# EAGLE design breakout-board (EAGLE 5.10)
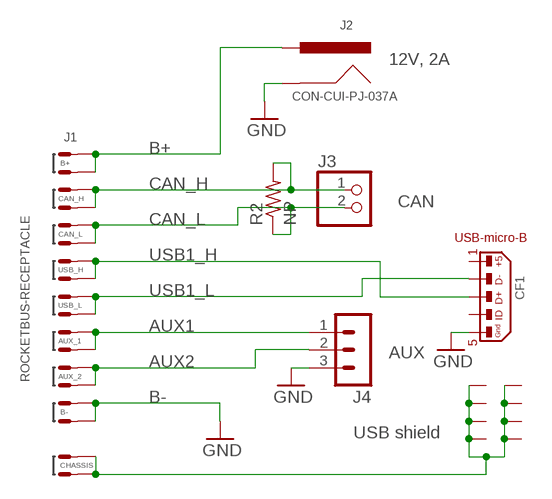
[diagram p0: schematic, sheet 1]

## Parts
CF1  CON_USB-MICRO-8GND-S-TH  [USB-MICRO-B-STD-PTH-HIROSE]
J1  ROCKETBUS-RECEPTACLE  [ROCKETBUS-RECEPTACLE]
J2  CON-CUI-PJ-037A  [CONN-CUI-PJ-037A]
J3  PINHD-1X2  [1X02]
J4  MA03-1  [MA03-1]
R2  NP  R-US_0603-B-NOSILK  [0603-B-NOSILK]

## Nets
AUX1: J1.AUX1@11(AUX_1) J1.AUX1@12(AUX_1) J4.1
AUX2: J1.AUX2@13(AUX_2) J1.AUX2@14(AUX_2) J4.2
B+: J1.B+@1(B+) J1.B+@2(B+) J2.TIP
CAN_H: J1.CAN_H@3(CAN_H) J1.CAN_H@4(CAN_H) J3.1 R2.2
CAN_L: J1.CAN_L@5(CAN_L) J1.CAN_L@6(CAN_L) J3.2 R2.1
GND: CF1.5 J1.B-@15(B-) J1.B-@16(B-) J2.RING J4.3
SHIELD: CF1.S1(GND) CF1.S1.B(G1.B:GND) CF1.S2(GND) CF1.S2.B(G2.B:GND) CF1.S3(GND) CF1.S3.B(G3.B:GND) CF1.S4(GND) CF1.S4.B(G4.B:GND) J1.CHASSIS@1(CHASSIS) J1.CHASSIS@2(CHASSIS)
USB1_H: CF1.3 J1.USB_H@7(USB_H) J1.USB_H@8(USB_H)
USB1_L: CF1.2 J1.USB_L@9(USB_L) J1.USB_L@10(USB_L)
Unconnected: CF1.1 CF1.4

## Notes on the sheet
- 12V, 2A
- CAN
- AUX
- B-
- USB shield

## Library data of the parts
CF1 = apdm:CON_USB-MICRO-8GND: USB micro connector
J1 = rocketbus:ROCKETBUS-RECEPTACLE
J2 = con-cui-pj-037a:CON-CUI-PJ-037A
J3 = pinhead:PINHD-1X2: PIN HEADER
J4 = con-lstb:MA03-1: PIN HEADER
R2 = rcl_custom:R-US_: RESISTOR, American symbol

## Board
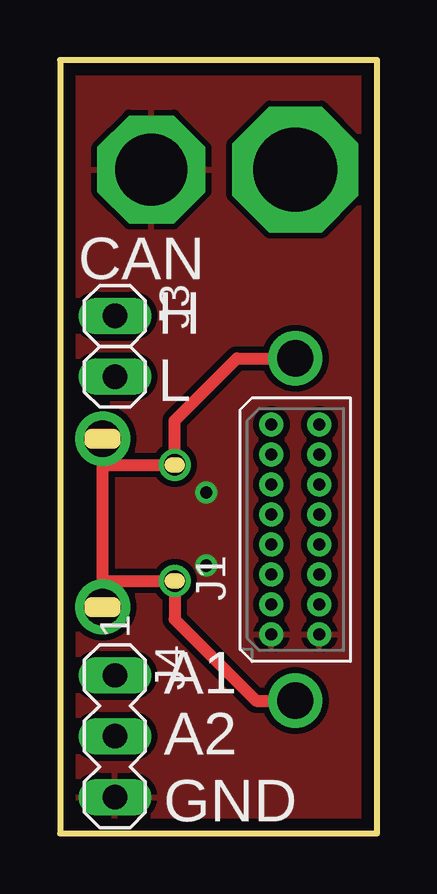
[diagram p1: board, top side]
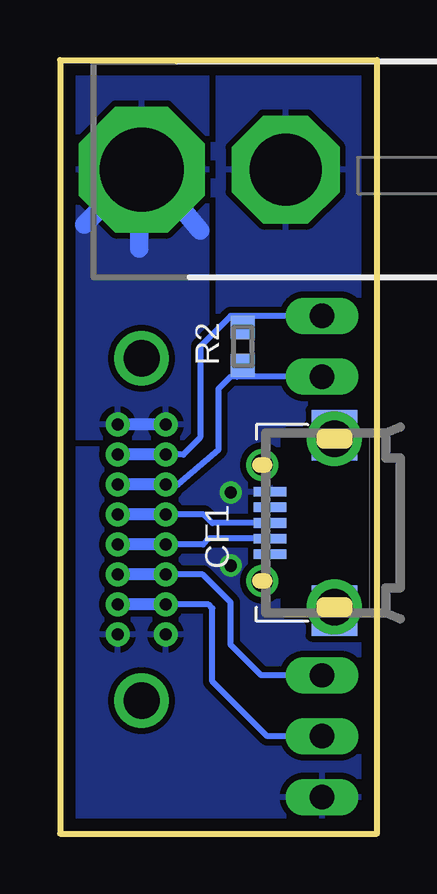
[diagram p2: board, bottom side, seen from below]

Size 13.21 x 32.26 mm. Coordinates in mm from the lower left corner, seen from the top.
Outline: 13.21,32.26 0,32.26 0,0 13.21,0 13.21,32.26
Copper layers (1*16): Top 0.0178mm / dielectric 1.4986mm / Bottom 0.0178mm
Design rules "sunstone_eagle_2lyr_rules_v1.0.0.3": minimum track width 6mil, minimum drill 14mil, track to track 6mil, track to pad 6mil, pad to pad 6mil, via to via 6mil, smd to smd 6mil, copper to edge 20mil, drill to drill 16mil, minimum pad ring 8mil, minimum via ring 8mil, stop-mask expansion 3mil, vias tented up to drill 0mil, thermal gap 10mil

### Footprints (pad centres in the part's own frame; a part is rotated, then mirrored left to right if it is on the bottom)
USB-MICRO-B-STD-PTH-HIROSE = smd 0.4 x 1.35: 1 -1.3,2.675; 2 -0.65,2.675; 3 0,2.675; 4 0.65,2.675; 5 1.3,2.675 | smd 2.1 x 1.9: S1 -3.65,0; S2 3.65,0 | smd 1.25 x 1.9 bottom: S1.B -3.5,0; S2.B 3.513,0 | smd 1.05 x 1.25: S3 -2.425,3; S4 2.425,3 | smd 1.05 x 1.25 bottom: S3.B -2.425,3; S4.B 2.425,3
ROCKETBUS-RECEPTACLE = drill 0.508 pad 1.016 round: AUX1@11 -1.875,1; AUX1@12 -1.875,-1; AUX2@13 -3.125,1; AUX2@14 -3.125,-1; B+@1 4.375,1; B+@2 4.375,-1; B-@15 -4.375,1; B-@16 -4.375,-1; CAN_H@3 3.125,1; CAN_H@4 3.125,-1; CAN_L@5 1.875,1; CAN_L@6 1.875,-1; USB_H@7 0.625,1; USB_H@8 0.625,-1; USB_L@9 -0.625,1; USB_L@10 -0.625,-1 | drill 1.511 round: CHASSIS@1 7.136,0; CHASSIS@2 -7.136,0
CONN-CUI-PJ-037A = drill 3 octagon: RING 0,0 | drill 3.5 octagon: TIP 6,0
1X02 = drill 1.016 long: 1 -1.27,0; 2 1.27,0
MA03-1 = drill 1.016 long: 1 -2.54,0; 2 0,0; 3 2.54,0
0603-B-NOSILK = smd 0.95 x 1: 1 -0.8,0; 2 0.8,0

### Placement (x,y rotation side)
CF1  1.78,12.95 90 bottom
J1  9.8,12.68 90 top
J2  3.81,27.69 180 bottom
J3  2.29,20.32 270 top
J4  2.29,4.06 270 top
R2  5.59,20.32 90 bottom

### Tracks (layer width: path | path; a pad name or v marks a point on that pad's centre or on a via)
AUX1
  Bottom 0.254: J1.AUX1@11 7.25,10.81 6.1,9.65 6.1,7.87 4.83,6.6 J4.1
  Bottom 0.508: J1.AUX1@11 J1.AUX1@12
AUX2
  Bottom 0.254: J1.AUX2@13 7.02,9.56 6.86,9.4 6.86,6.35 4.57,4.06 J4.2
  Bottom 0.508: J1.AUX2@13 J1.AUX2@14
B+
  Bottom 0.508: J1.B+@1 J1.B+@2
  Bottom 0.762: 7.37,25.15 8.64,26.67 9.91,26.67 | 9.91,26.67 10.92,26.67 12.19,25.4 | 9.91,26.67 9.91,24.38
  pour Bottom (isolate 0.254): 7.11,16.51 13.21,16.51 13.21,32.26 7.11,32.26
CAN_H
  Bottom 0.254: J1.CAN_H@3 8.07,15.81 7.37,16.51 7.37,20.32 6.1,21.59 5.59,21.59 | J3.1 5.59,21.59 | 5.59,21.59 R2.2
  Bottom 0.508: J1.CAN_H@3 J1.CAN_H@4
CAN_L
  Bottom 0.254: J1.CAN_L@5 8.3,14.56 6.6,16 6.6,18.54 6.1,19.05 5.84,19.05 | J3.2 5.84,19.05 | R2.1 5.59,19.3 5.84,19.05
  Bottom 0.508: J1.CAN_L@5 J1.CAN_L@6
GND  (via drill 0.51)
  other vias: 6.1,14.22 6.1,11.18
  pour Top (isolate 0.254): 13.21,32.26 13.21,0 0,0 0,32.26
  pour Bottom (isolate 0.254, rank 2): 13.21,32.26 0,32.26 0,0 13.21,0
SHIELD  (via drill 0.89, 1.52)  (2 unrouted)
  Top 0.254: 1.78,10.67 1.92,10.53 | 1.78,15.24 1.92,15.38
  Top 0.508: CF1.S1.B 1.78,10.67 1.78,15.24 CF1.S2.B CF1.S2 | 1.92,10.53 CF1.S3 4.78,8.94 8.17,5.55 J1.CHASSIS@2 | 1.92,15.38 CF1.S4 4.78,17.22 7.37,19.82 J1.CHASSIS@1
  other vias: 1.78,16.47 4.78,15.38 4.78,10.53 1.78,9.45
USB1_H
  Bottom 0.254: CF1.3 6.86,12.95 7.21,13.31 J1.USB_H@7
  Bottom 0.508: J1.USB_H@7 J1.USB_H@8
USB1_L
  Bottom 0.254: CF1.2 7,12.3 7.25,12.06 J1.USB_L@9
  Bottom 0.508: J1.USB_L@9 J1.USB_L@10

### Text on the board
tPlace: CAN | H | L | A1 | A2 | GND